# Altium schematic sheet S-ONDAS-ESPIN.SchDoc: SENSOR DE ONDAS DE ESPÍN
size A3; ApprovedBy: ---; Author: MARIO DE MIGUEL; SheetNumber: 6; SheetTotal: 7; ProjectTitle: SENSACIONAL 2
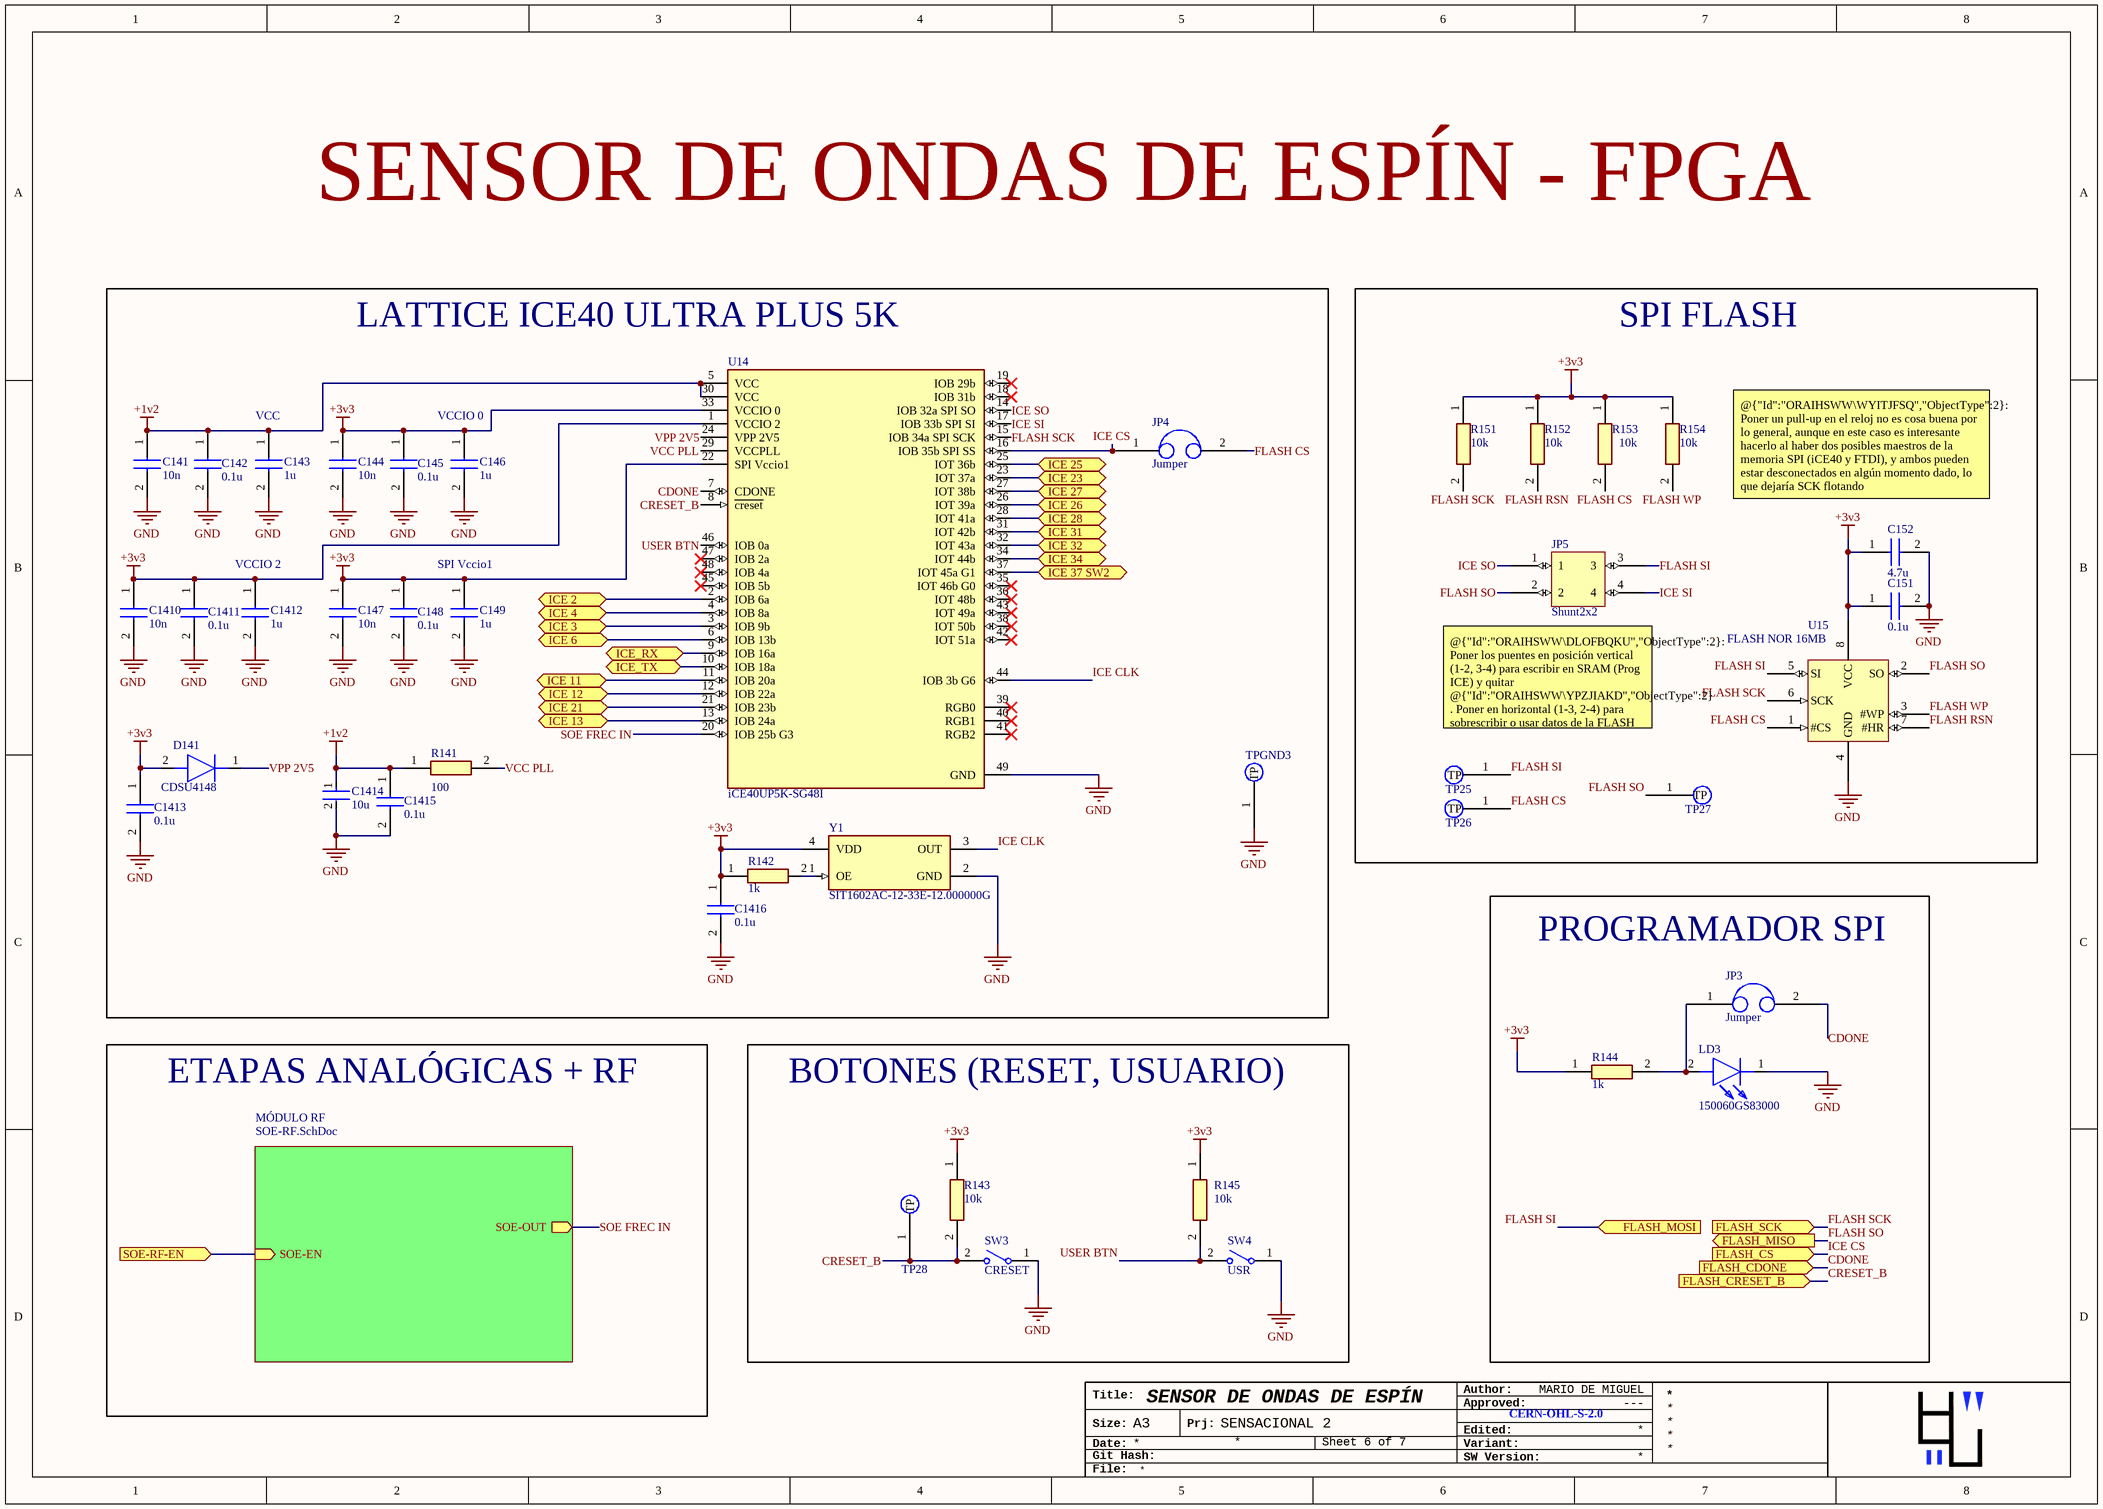
[diagram p0: S-ONDAS-ESPIN.SchDoc]

## Parts
C141  10n  [CAPC1005X55N]
C142  0.1u  [CAPC1005X22N]
C143  1u  [GRM15x]
C144  10n  [CAPC1005X55N]
C145  0.1u  [CAPC1005X22N]
C146  1u  [GRM15x]
C147  10n  [CAPC1005X55N]
C148  0.1u  [CAPC1005X22N]
C149  1u  [GRM15x]
C151  0.1u  [CAPC1005X22N]
C152  4.7u  [C0805]
C1410  10n  [CAPC1005X55N]
C1411  0.1u  [CAPC1005X22N]
C1412  1u  [GRM15x]
C1413  0.1u  [CAPC1005X22N]
C1414  10u  [FP-C2012-125-0_2-MFG]
C1415  0.1u  [CAPC1005X22N]
C1416  0.1u  [CAPC1005X22N]
D141  CDSU4148  [DIOM179X85N]
JP3  Jumper  [JUMPER_SHUNT]  (no BOM)
JP4  Jumper  [JUMPER_SHUNT]  (no BOM)
JP5  Shunt2x2  [JUMPER_SHUNT2X2]  (no BOM)
LD3  150060GS83000  [LEDC1608X95N]
R141  100  [RESC1608X50N]
R142  1k  [ERA6AEB101V]
R143  10k  [RESC1005X40N]
R144  1k  [ERA6AEB101V]
R145  10k  [RESC1005X40N]
R151  10k  [RESC1005X40N]
R152  10k  [RESC1005X40N]
R153  10k  [RESC1005X40N]
R154  10k  [RESC1005X40N]
SW3  CRESET  [434121025816]
SW4  USR  [434121025816]
TP25  Testpoint  [TESTPOINT_SMD]  (value not drawn)  (no BOM)
TP26  Testpoint  [TESTPOINT_SMD]  (value not drawn)  (no BOM)
TP27  Testpoint  [TESTPOINT_SMD]  (value not drawn)  (no BOM)
TP28  Testpoint  [Testpoint_TH]  (value not drawn)  (no BOM)
TPGND3  Testpoint  [Testpoint_TH]  (value not drawn)  (no BOM)
U14  iCE40UP5K-SG48I  [FP-QFN-48-IPC_C]
U15  FLASH NOR 16MB  [SOIC127P790X216-8N]
Y1  SIT1602AC-12-33E-12.000000G  [FP-SiT1602-1-MFG]

## Blocks framed on the sheet
SPI FLASH: C151 C152 JP5 R151-R154 TP25-TP27 U15
PROGRAMADOR SPI: JP3 LD3 R144
BOTONES (RESET, USUARIO): R143 R145 SW3 SW4 TP28

## Sub-sheets
MÓDULO RF = SOE-RF.SchDoc: SOE-OUT (out), SOE-EN (in)

## Ports
FLASH_CDONE (in), FLASH_CRESET_B (in), FLASH_CS (in), FLASH_MISO (out), FLASH_MOSI (in), FLASH_SCK (in), ICE 2 (bidir), ICE 3 (bidir), ICE 4 (bidir), ICE 6 (bidir), ICE 11 (bidir), ICE 12 (bidir), ICE 13 (bidir), ICE 21 (bidir), ICE 23 (bidir), ICE 25 (bidir), ICE 26 (bidir), ICE 27 (bidir), ICE 28 (bidir), ICE 31 (bidir), ICE 32 (bidir), ICE 34 (bidir), ICE 37 SW2 (bidir), ICE_RX (bidir), ICE_TX (bidir), SOE-RF-EN (in)

## Nets
+1v2: C141.1 C142.1 C143.1 C1414.1 C1415.1 R141.1 U14.5(VCC) U14.30(VCC)
+3v3: C144.1 C145.1 C146.1 C147.1 C148.1 C149.1 C151.1 C152.1 C1410.1 C1411.1 C1412.1 C1413.1 C1416.1 D141.2(A) R142.1 R143.1 R144.1 R145.1 R151.1 R152.1 R153.1 R154.1 U14.1(VCCIO_2) U14.22(SPI_Vccio1) U14.33(VCCIO_0) U15.8(VCC) Y1.4(VDD)
GND: C141.2 C142.2 C143.2 C144.2 C145.2 C146.2 C147.2 C148.2 C149.2 C151.2 C152.2 C1410.2 C1411.2 C1412.2 C1413.2 C1414.2 C1415.2 C1416.2 LD3.1(K) SW3.1 SW4.1 TPGND3.1(TP) U14.49(GND) U15.4(GND) Y1.2(GND)
CDONE: JP3.2 U14.7(CDONE) ; port FLASH_CDONE
CRESET_B: R143.2 SW3.2 TP28.1(TP) U14.8(~{creset}) ; port FLASH_CRESET_B
FLASH CS: JP4.2 R153.2 TP26.1(TP) U15.1(#CS)
FLASH RSN: R152.2 U15.7(#HR)
FLASH SCK: R151.2 U14.15(IOB_34a_SPI_SCK) U15.6(SCK) ; port FLASH_SCK
FLASH SI: JP5.3 TP25.1(TP) U15.5(SI) ; port FLASH_MOSI
FLASH SO: JP5.2 TP27.1(TP) U15.2(SO) ; port FLASH_MISO
FLASH WP: R154.2 U15.3(#WP)
ICE 2: U14.2(IOB_6a) ; port ICE 2
ICE 3: U14.3(IOB_9b) ; port ICE 3
ICE 4: U14.4(IOB_8a) ; port ICE 4
ICE 6: U14.6(IOB_13b) ; port ICE 6
ICE 11: U14.11(IOB_20a) ; port ICE 11
ICE 12: U14.12(IOB_22a) ; port ICE 12
ICE 13: U14.13(IOB_24a) ; port ICE 13
ICE 21: U14.21(IOB_23b) ; port ICE 21
ICE 23: U14.23(IOT_37a) ; port ICE 23
ICE 25: U14.25(IOT_36b) ; port ICE 25
ICE 26: U14.26(IOT_39a) ; port ICE 26
ICE 27: U14.27(IOT_38b) ; port ICE 27
ICE 28: U14.28(IOT_41a) ; port ICE 28
ICE 31: U14.31(IOT_42b) ; port ICE 31
ICE 32: U14.32(IOT_43a) ; port ICE 32
ICE 34: U14.34(IOT_44b) ; port ICE 34
ICE 37 SW2: U14.37(IOT_45a_G1) ; port ICE 37 SW2
ICE CLK: U14.44(IOB_3b_G6) Y1.3(OUT)
ICE CS: JP4.1 U14.16(IOB_35b_SPI_SS) ; port FLASH_CS
ICE SI: JP5.4 U14.17(IOB_33b_SPI_SI)
ICE SO: JP5.1 U14.14(IOB_32a_SPI_SO)
ICE_RX: U14.9(IOB_16a) ; port ICE_RX
ICE_TX: U14.10(IOB_18a) ; port ICE_TX
SOE FREC IN: U14.20(IOB_25b_G3) ; sheet MÓDULO RF/SOE-OUT
SOE-RF-EN: port SOE-RF-EN, sheet MÓDULO RF/SOE-EN
USER BTN: R145.2 SW4.2 U14.46(IOB_0a)
VCC PLL: R141.2 U14.29(VCCPLL)
VPP 2V5: D141.1(K) U14.24(VPP_2V5)
NetJP3_1: JP3.1 LD3.2(A) R144.2
NetR142_2: R142.2 Y1.1(OE)

Not connected (* = marked no-connect by the designer): U14 18(IOB_31b)* 19(IOB_29b)* 35(IOT_46b_G0)* 36(IOT_48b)* 38(IOT_50b)* 39(RGB0)* 40(RGB1)* 41(RGB2)* 42(IOT_51a)* 43(IOT_49a)* 45(IOB_5b)* 47(IOB_2a)* 48(IOB_4a)*

## Notes on the sheet
- SENSOR DE ONDAS DE ESPÍN - FPGA
- (near U14) LATTICE ICE40 ULTRA PLUS 5K
- (near C143) VCC
- VCCIO 0
- @{"Id":"ORAIHSWW\WYITJFSQ","ObjectType":2}: Poner un pull-up en el reloj no es cosa buena por lo general, aunque en este caso es interesante hacerlo al haber dos posibles maestros de la memoria SPI (iCE40 y FTDI), y ambos pueden estar desconectados en algún momento dado, lo que dejaría SCK flotando
- VCCIO 2
- SPI Vccio1
- @{"Id":"ORAIHSWW\DLOFBQKU","ObjectType":2}: Poner los puentes en posición vertical (1-2, 3-4) para escribir en SRAM (Prog ICE) y quitar @{"Id":"ORAIHSWW\YPZJIAKD","ObjectType":2} . Poner en horizontal (1-3, 2-4) para sobrescribir o usar datos de la FLASH (Prog FLASH).
- ETAPAS ANALÓGICAS + RF
- Title:
- Author:
- Approved:
- Size:
- Date:
- Git Hash:
- A3
- Prj:
- SW Version:
- Variant:
- Edited:
- CERN-OHL-S-2.0
- File:

## Library data of the parts
C141 C144 C147 C1410 = GXT155R71E103KE01D: Capacitor; Manufacturer_Name: Murata Electronics; Datasheet Link: https://pim.murata.com/en-global/pim/details/?partNum=GXT155R71E103KE01%23&productCategoryId=ceramicCapacitorSMD&displayChangeClass=productDetailPrint; Height: 0.55mm; Manufacturer_Part_Number: GXT155R71E103KE01D
C142 C145 C148 C151 C1411 C1413 C1415 C1416 = GRM152R61A104KE19D: Capacitor; Manufacturer_Name: Murata Electronics; Datasheet Link: https://search.murata.co.jp/Ceramy/image/img/A01X/G101/ENG/GRM152R61A104KE19-01A.pdf; Height: 0.22mm; Manufacturer_Part_Number: GRM152R61A104KE19D; Mouser Part Number: 81-GRM152R61A104KE9D; Mouser Price/Stock: https://www.mouser.co.uk/ProductDetail/Murata-Electronics/GRM152R61A104KE19D?qs=IPQhFcwEUOjgOs7G%2Fz457g%3D%3D; Arrow Part Number: GRM152R61A104KE19D; Arrow Price/Stock: https://www.arrow.com/en/products/grm152r61a104ke19d/murata-manufacturing
C143 C146 C149 C1412 = GRM155C71C105ME11J: Capacitor; Manufacturer_Name: Murata Electronics; Datasheet Link: https://search.murata.co.jp/Ceramy/image/img/A01X/G101/ENG/GRM155C71C105ME11-01A.pdf; Height: 0.33mm; Manufacturer_Part_Number: GRM155C71C105ME11J
C152 = C0805X475J8RACAUTO: Capacitor; Manufacturer_Name: KEMET; Datasheet Link: https://content.kemet.com/datasheets/KEM_C1078_X7R_FT-CAP_AUTO_SMD.pdf; Height: 1.1mm; Manufacturer_Part_Number: C0805X475J8RACAUTO; Mouser Part Number: 80-C0805X475J8RAUTO; Mouser Price/Stock: https://www.mouser.co.uk/ProductDetail/KEMET/C0805X475J8RACAUTO?qs=HXFqYaX1Q2zZ0fA5cxYngw%3D%3D; Arrow Part Number: C0805X475J8RACAUTO; Arrow Price/Stock: https://www.arrow.com/en/products/c0805x475j8racauto/kemet-corporation?region=nac
C1414 = CMP-2000-05452-2: Multilayer Ceramic Capacitors 10μF ±10% 10V X7R SMD 0805; Capacitance: 10uF; Series: C; Case/Package: 0805; REACH SVHC: No SVHC; Tolerance: 10%; Resistor Type: Ceramic; Termination: SMD/SMT; Weight: 0.000194oz; Depth: 1.25mm; Construction: Flat; RoHS Compliant: Yes; Contact Plating: Tin; Packaging: Tape and Reel; Mount: Surface Mount; Thickness: 0.057inch; Radiation Hardening: No; Dielectric: X7R; Min Operating Temperature: -55°C; Voltage Rating (DC): 10V; Voltage: 10V; Width: 0.049inch; Package Quantity: 1; Number of Pins: 2; Height: 1.25mm; Max Operating Temperature: 125°C; Dielectric Material: Ceramic; Case Code (Imperial): 0805; Lead Free: Lead Free; Voltage Rating: 10V; Case Code (Metric): 2012; Length: 2mm
D141 = CDSU4148: Diode; Manufacturer_Name: Comchip Technology; Datasheet Link: https://datasheet.datasheetarchive.com/originals/distributors/Datasheets-7/DSA-139250.pdf; Height: 0.85mm; Manufacturer_Part_Number: CDSU4148; Mouser Part Number: 750-CDSU4148; Mouser Price/Stock: https://www.mouser.co.uk/ProductDetail/Comchip-Technology/CDSU4148?qs=tw%252BuQ%2FB6PO1A4Pq3N4jPEA%3D%3D; Arrow Part Number: CDSU4148; Arrow Price/Stock: https://www.arrow.com/en/products/cdsu4148/comchip-technology?region=nac
JP3 JP4 = Shunt
LD3 = 150060GS83000: LED; Manufacturer_Name: Wurth Elektronik; Datasheet Link: https://www.we-online.com/components/products/download/3D_WL-SMCW_150060xx83000+%28rev1%29.pdf; Height: 0.95mm; Manufacturer_Part_Number: 150060GS83000
R141 = RCG0603100RJNEA: Resistor; Manufacturer_Name: Vishay; Datasheet Link: https://www.vishay.com/docs/20047/rcge3.pdf; Height: 0.5mm; Manufacturer_Part_Number: RCG0603100RJNEA; Mouser Part Number: 71-RCG0603100RJNEA; Mouser Price/Stock: https://www.mouser.co.uk/ProductDetail/Vishay-Draloric/RCG0603100RJNEA?qs=vOeJqewp7jCqV7U9XHMqLA%3D%3D
R142 R144 = ERA-6ARW102V: Resistor; Manufacturer_Name: Panasonic; Datasheet Link: https://industrial.panasonic.com/cdbs/www-data/pdf/RDM0000/AOA0000C307.pdf; Height: 0.6mm; Manufacturer_Part_Number: ERA-6ARW102V; Mouser Part Number: 667-ERA-6ARW102V; Mouser Price/Stock: https://www.mouser.co.uk/ProductDetail/Panasonic/ERA-6ARW102V?qs=ob%252BdNz2%252BYEgF8szbcT859A%3D%3D
R143 R145 R151-R154 = RCA040210K0JNED: Resistor; Manufacturer_Name: Vishay; Datasheet Link: https://www.vishay.com/docs/20037/rcae3.pdf; Height: 0.4mm; Manufacturer_Part_Number: RCA040210K0JNED; Mouser Part Number: 71-RCA040210K0JNED; Mouser Price/Stock: https://www.mouser.co.uk/ProductDetail/Vishay-Draloric/RCA040210K0JNED?qs=MG8z16zmaH46yN0G7Zhn3Q%3D%3D; Arrow Part Number: RCA040210K0JNED; Arrow Price/Stock: https://www.arrow.com/en/products/rca040210k0jned/vishay?region=nac
SW3 SW4 = CMP-1459-00004-3: Switch Tactile Spst-no 0.05A 12V; Operating Force: 1.56N; Contact Resistance: 100mΩ; Switch Function: Off-Mom; Mechanical Life: 50kcycles; Switch Travel: 250µm; Actuator Material: Liquid Crystal Polymer, Polymer; Current Rating: 50mA; Throw Configuration: SPST; Actuator Length: 800µm; Illumination Type: Illuminated, Non-Illuminated; Color: Black; Height: 2.5mm; Contact Material: Stainless Steel, Steel; Voltage Rating: 12V; Packaging: Tape and Reel; Contact Plating: Silver; Max Operating Temperature: 85°C; RoHS: Compliant; Lead Free: Lead Free; Termination: SMD/SMT; REACH SVHC: No SVHC; Mount: Surface Mount; Min Operating Temperature: -40°C; Length: 7.3mm; Insulation Resistance: 100MΩ; Contact Current Rating: 50mA
U14 = CMP-17932-000001-1: ICE40-ULTRAPLUS, 5280 LUTS, 1.2V; Manufacturer: Lattice; Propagation Delay: 9ns; Frequency: 48MHz; Max Junction Temp: +100°C; Ram Size: 1024Kbits; Number Of Logic Elements Cells: 5280; Number Of I/Os: 39; Max Supply Voltage: 3.46V; Standoff Height: 0mm; Nominal Supply Current: 2.5-12mA; Min Supply Voltage: 1.14V; Number Of Logic Blocks: 660; Device Class L3: FPGAs - Field Programmable Gate Arrays; Temperature Range High: +100°C; Device Class L1: Integrated Circuits (ICs); Device Class L2: Embedded Processors and Controllers; Ipc Land Pattern Name: QFN50P700X700X90-48; Automotive: No; RoHS: TRUE; Lead Free: Yes; Height: 1mm; ComponentLink2Description: Datasheet; Manufacturer Part Number: iCE40UP5K-SG48I; Temperature Range Low: -40°C; Package: QFN-48; Temperature: -40°C to +100°C; Octopart: https://octopart.com/ice40up5k-sg48i-lattice+semiconductor-87369311; Footprint Url: http://www.latticesemi.com/view_document?document_id=213; Digikey Description: ICE40-ULTRAPLUS, 5280 LUTS, 1.2V; ComponentLink2URL: http://www.latticesemi.com/view_document?document_id=51968; Category: IC
U15 = IS25LP016D-JBLE
Y1 = CMP-25159-259630-1: MEMS OSC XO 12.0000MHZ LVCMOS